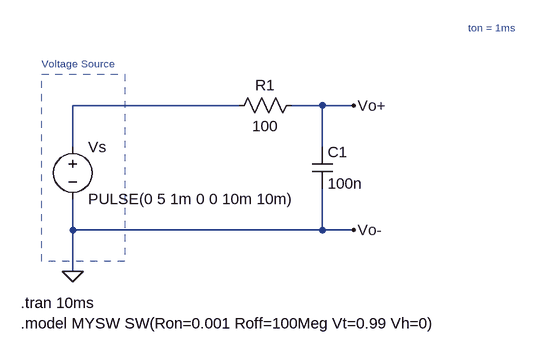
[diagram p0: schematic Lab 2 Experiment 2.asc]
Lab 2 Experiment 2.asc, the LTspice schematic file:
Version 4
SHEET 1 880 680
WIRE 64 48 -192 48
WIRE 192 48 144 48
WIRE 240 48 192 48
WIRE -192 112 -192 48
WIRE 192 112 192 48
WIRE -192 240 -192 192
WIRE 192 240 192 176
WIRE 192 240 -192 240
WIRE 240 240 192 240
WIRE -192 304 -192 240
FLAG -192 304 0
FLAG 240 48 Vo+
FLAG 240 240 Vo-
DATAFLAG -176 48 ""
SYMBOL voltage -192 96 R0
WINDOW 123 0 0 Left 0
WINDOW 39 0 0 Left 0
SYMATTR InstName Vs
SYMATTR Value PULSE(0 5 1m 0 0 10m 10m)
SYMBOL res 160 32 R90
WINDOW 0 0 56 VBottom 2
WINDOW 3 32 56 VTop 2
SYMATTR InstName R1
SYMATTR Value 100
SYMBOL cap 176 112 R0
SYMATTR InstName C1
SYMATTR Value 100n
TEXT -240 -16 Left 1 ;Voltage Source
TEXT -272 352 Left 2 !.tran 10ms
TEXT -272 384 Left 2 !.model MYSW SW(Ron=0.001 Roff=100Meg Vt=0.99 Vh=0)
TEXT 416 -72 Left 1 ;ton = 1ms
RECTANGLE Normal -112 288 -240 0 2

The netlist it stands for:
* Lab 2 Experiment 2.asc
Vs N001 0 PULSE(0 5 1m 0 0 10m 10m)
R1 Vo+ N001 100
C1 Vo+ 0 100n
* Voltage Source
.tran 10ms
.model MYSW SW(Ron=0.001 Roff=100Meg Vt=0.99 Vh=0)
* ton = 1ms
.backanno
.end